# Altium project 14-Bit_ADC_ADC.PrjPcb
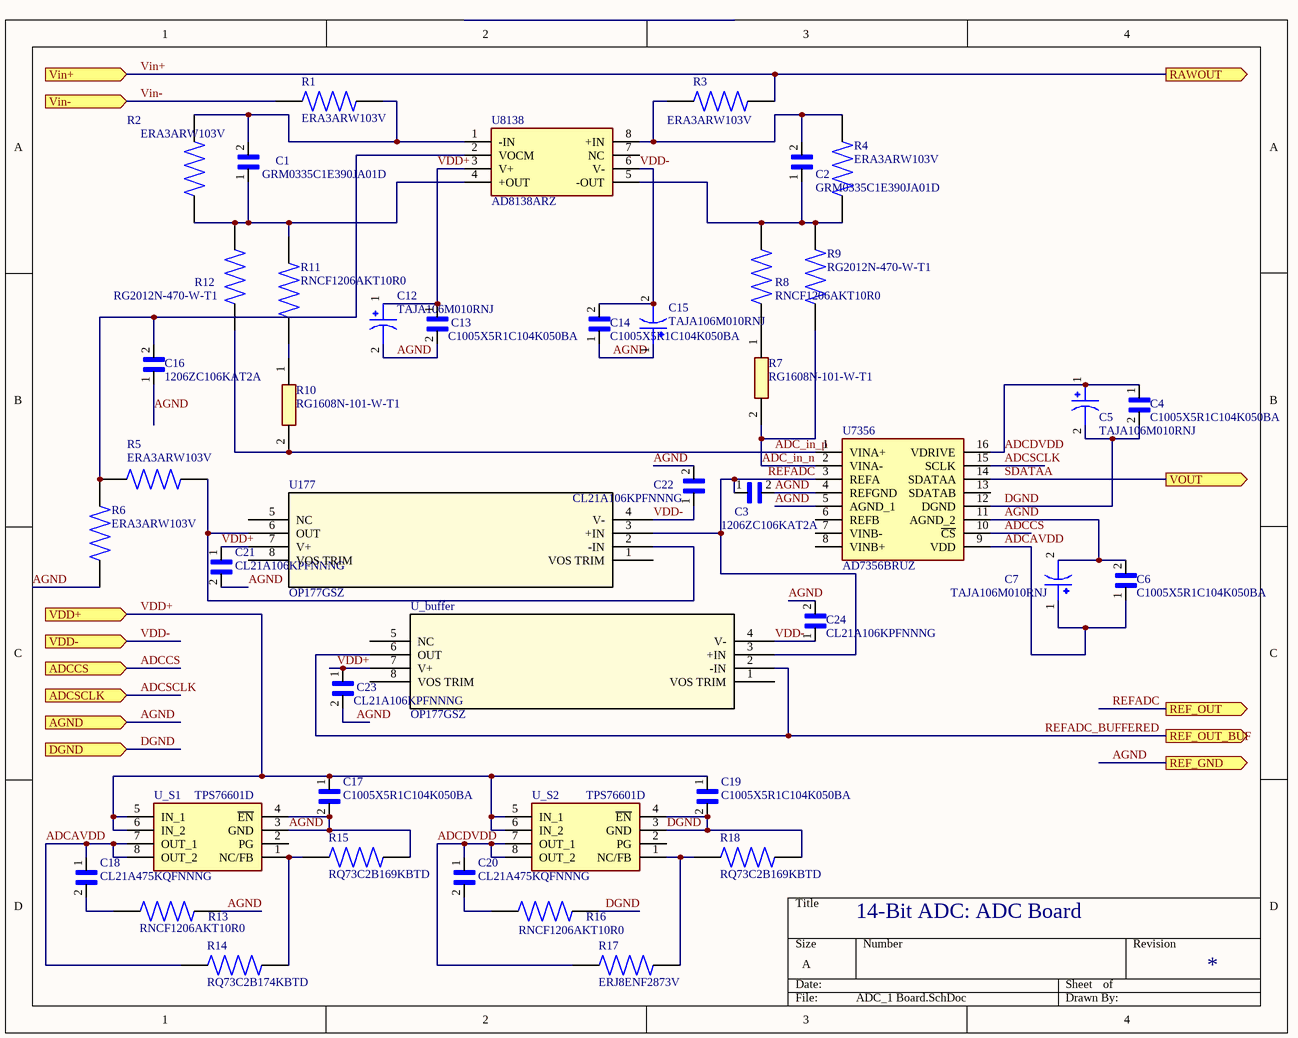
[diagram p0: ADC_1 Board.SchDoc]
1 sheet, 44 parts. Net scope: flat (ports and power ports of the same name join across sheets).
Board file: ADC_PCB.PcbDoc

## Sheet ADC_1 Board.SchDoc
size A; SheetNumber: 1; SheetTotal: 2; SPICEModelCachePBYFTRTB: <root> / <DocumentId>PBYFTRTB</DocumentId> / <CacheFrame Number="0"> / <Model Name="op1177" Kind="CKT"> / <Text>* OP1177 SPICE Macro-model / * Description: Amplifier / * Generic Desc: 6/30V, BIP, OP, Low Vos, Low TcVos, 1X / * Developed by: SB, ADSiV apps / * Revision History: 08/10/2012 - Updated to new header style / * 1.0 (05/2002) / * Copyright 2002, 2012 by Analog Devices, Inc. / * / * Refer to http://www.analog.com/Analog_Root/static/techSupport/designTools/spiceModels/license/spice_general.html for License Statement. Use of this model / * indicates your acceptance of the terms and provisions in the License Statement. / * / * BEGIN Notes: / * / * Not Modeled: / * / * Parameters modeled include: Vsy=±15V / * / * END Notes / * / * Node assignments / *               non-inverting input / *               | inverting input / *               | | positive supply / *               | | |  negative supply / *               | | |  |  output / *               | | |  |  | / *               | | |  |  | / .SUBCKT OP1177  1 2 99 50 34 / * / * INPUT STAGE &amp; POLE AT 100 MHZ / * / R3   5 51     6.8E3 / R4   6 51     6.8E3 / CIN  1  2     1.5E-12 / C2   5  6      3.5E-12 / I1   97 4      500E-6 / IOS  1  2     0.1E-9 / EOS  9  3     POLY(2)  (26, 28) (73, 98) 15E-6  1 1 / Q1   5  2  7  QX / Q2   6  9  8  QX / R5   7  4     50 / R6   8  4     50 / D1   2 36     DZ / D2   1 36     DZ / EN   3  1     10  0  1 / GN1  0  2     13  0  1 / GN2  0  1     16  0  1 / * / EREF 98 0     28  0  1 / EP   97 0     99  0  1 / EM   51 0     50  0  1 / * / * VOLTAGE NOISE SOURCE / * / DN1  35 10    DEN / DN2  10 11    DEN / VN1  35  0    DC 2 / VN2  0  11    DC 2 / * / * CURRENT NOISE SOURCE / * / DN3  12 13    DIN / DN4  13 14    DIN / VN3  12  0    DC 2 / VN4  0  14    DC 2 / * / * CURRENT NOISE SOURCE / * / DN5  15 16    DIN / DN6  16 17    DIN / VN5  15  0    DC 2 / VN6  0  17    DC 2 / * / * GAIN STAGE &amp; DOMINANT POLE AT 0.439 HZ / * / R7  18 98     1.45E7 / C3  18 98     25E-9 / G1  98 18     5  6  5.15E-3 / V2  97 19     1.5 / V3  20 51     1.5 / D3  18 19     DX / D4  20 18     DX / * / * POLE/ZERO PAIR AT 1.5MHz/12.7MHz / * / R8  21 98     1E3 / R9  21 22     1.25E3 / C4  22 98     10E-12 / G2  98 21     18 28  1E-3 / * / * POLE AT 2568 MHz / * / R10 23 98     1 / C5  23 98     62E-12 / G3  98 23     21 28  1 / * / * POLE AT 2568 MHz / * / R11 24 98     1 / C6  24 98     62E-12 / G4  98 24     23 28  1 / * / * POLE AT 2568 MHz / * / R14 27 98     1 / C8  27 98    62E-12 / G5  98 27     24 28  1 / * / * COMMON-MODE GAIN NETWORK WITH ZERO AT 1 kHZ / * / R12 25 26     1E6 / C7  25 26     159.155E-12 / R13 26 98     1 / E2  25 98      POLY(2) 1 98 2 98 0 0.28 0.28 / * / *PSRR=121dB / EPSY 98 72 POLY(1) (99,50) 0 1 / RPS3 72 73 1E6 / CPS3 72 73 3E-9 / RPS4 73 98 1 / * OUTPUT STAGE / * / R15 28 99     100E3 / R16 28 50     100E3 / C9  28 50     1E-6 / ISY 99 50     250E-6 / R17 29 99     100 / R18 29 50     100 / L2  29 34     1E-9 / G6  32 50     27 29  10E-3 / G7  33 50     29 27  10E-3 / G8  29 99     99 27  10E-3 / G9  50 29     27 50  10E-3 / V4  30 29     1.3 / V5  29 31     3.8 / F1  29  0     V4  1 / F2  0  29     V5  1 / D5  27 30     DX / D6  31 27     DX / D7  99 32     DX / D8  99 33     DX / D9  50 32     DY / D10 50 33     DY / * / * MODELS USED / * / .MODEL QX PNP(BF=5E5) / .MODEL DX   D(IS=1E-12) / .MODEL DY   D(IS=1E-15 BV=50) / .MODEL DZ   D(IS=1E-15 BV=7.0) / .MODEL DEN  D(IS=1E-12 RS=6.8E3 KF=1.95E-15 AF=1) / .MODEL DIN  D(IS=1E-12 RS=77.3E-6 KF=3.38E-15 AF=1) / .ENDS OP1177</Text> / </Model> / </CacheFrame> / </root>

### Parts
C1  GRM0335C1E390JA01D  [CAPC0603X33N]
C2  GRM0335C1E390JA01D  [CAPC0603X33N]
C3  1206ZC106KAT2A  [CAPC3216X178N]
C4  C1005X5R1C104K050BA  [CAPC1005X55N]
C5  TAJA106M010RNJ  [CAPMP3216X180N]
C6  C1005X5R1C104K050BA  [CAPC1005X55N]
C7  TAJA106M010RNJ  [CAPMP3216X180N]
C12  TAJA106M010RNJ  [CAPMP3216X180N]
C13  C1005X5R1C104K050BA  [CAPC1005X55N]
C14  C1005X5R1C104K050BA  [CAPC1005X55N]
C15  TAJA106M010RNJ  [CAPMP3216X180N]
C16  1206ZC106KAT2A  [CAPC3216X178N]
C17  C1005X5R1C104K050BA  [CAPC1005X55N]
C18  CL21A475KQFNNNG  [CAPC2012X135N]
C19  C1005X5R1C104K050BA  [CAPC1005X55N]
C20  CL21A475KQFNNNG  [CAPC2012X135N]
C21  CL21A106KPFNNNG  [CAPC2012X135N]
C22  CL21A106KPFNNNG  [CAPC2012X135N]
C23  CL21A106KPFNNNG  [CAPC2012X135N]
C24  CL21A106KPFNNNG  [CAPC2012X135N]
R1  ERA3ARW103V  [RES_ERA3ARW103V]
R2  ERA3ARW103V  [RES_ERA3ARW103V]
R3  ERA3ARW103V  [RES_ERA3ARW103V]
R4  ERA3ARW103V  [RES_ERA3ARW103V]
R5  ERA3ARW103V  [RES_ERA3ARW103V]
R6  ERA3ARW103V  [RES_ERA3ARW103V]
R7  RG1608N-101-W-T1  [RESC1608X50N]
R8  RNCF1206AKT10R0  [RESC3015X65N]
R9  RG2012N-470-W-T1  [RESC2012X50N]
R10  RG1608N-101-W-T1  [RESC1608X50N]
R11  RNCF1206AKT10R0  [RESC3015X65N]
R12  RG2012N-470-W-T1  [RESC2012X50N]
R13  RNCF1206AKT10R0  [RESC3015X65N]
R14  RQ73C2B174KBTD  [RESC3116X75N]
R15  RQ73C2B169KBTD  [RESC3116X75N]
R16  RNCF1206AKT10R0  [RESC3015X65N]
R17  ERJ8ENF2873V  [RES_ERJ8ENF2873V]
R18  RQ73C2B169KBTD  [RESC3116X75N]
U177  OP177GSZ  [R_8_ADI]
U7356  AD7356BRUZ  [SOP65P640X120-16N]
U8138  AD8138ARZ  [SOIC127P600X175-8N]
U_buffer  OP177GSZ  [R_8_ADI]
U_S1  TPS76601D  [SOIC127P600X175-8N]
U_S2  TPS76601D  [SOIC127P600X175-8N]

### Ports
ADCCS (in), ADCSCLK (in), AGND (in), DGND (in), RAWOUT (out), REF_GND (out), REF_OUT (out), REF_OUT_BUF (out), VDD+ (in), VDD- (in), Vin+ (in), Vin- (in), VOUT (out)

### Nets
ADC_in_n: R7.2 R9.2 U7356.2(VINA-)
ADC_in_p: R10.2 R12.2 U7356.1(VINA+)
ADCAVDD: C6.1 C7.1 C18.1 R14.1 U7356.9(VDD) U_S1.7(OUT_1) U_S1.8(OUT_2)
ADCCS: U7356.10(~{CS}) ; port ADCCS
ADCDVDD: C4.1 C5.1 C20.1 R17.1 U7356.16(VDRIVE) U_S2.7(OUT_1) U_S2.8(OUT_2)
ADCSCLK: U7356.15(SCLK) ; port ADCSCLK
AGND: C3.2 C6.2 C7.2 C12.2 C13.2 C14.1 C15.1 C16.1 C17.2 C21.2 C22.2 C23.2 C24.2 R6.2 R13.1 R15.2 U7356.4(REFGND) U7356.5(AGND_1) U7356.11(AGND_2) U_S1.3(GND) U_S1.4(~{EN}) ; port AGND, port REF_GND
DGND: C4.2 C5.2 C19.2 R16.1 R18.2 U7356.12(DGND) U_S2.3(GND) U_S2.4(~{EN}) ; port DGND
REFADC: C3.1 U177.3(+IN) U7356.3(REFA) U_buffer.3(+IN) ; port REF_OUT
REFADC_BUFFERED: U_buffer.2(-IN) U_buffer.6(OUT) ; port REF_OUT_BUF
SDATAA: U7356.14(SDATAA) ; port VOUT
VDD+: C12.1 C13.1 C17.1 C19.1 C21.1 C23.1 U177.7(V+) U8138.3(V+) U_buffer.7(V+) U_S1.5(IN_1) U_S1.6(IN_2) U_S2.5(IN_1) U_S2.6(IN_2) ; port VDD+
VDD-: C14.2 C15.2 C22.1 C24.1 U177.4(V-) U8138.6(V-) U_buffer.4(V-) ; port VDD-
Vin+: R3.1 ; port Vin+, port RAWOUT
Vin-: R1.2 ; port Vin-
NetC1_1: C1.1 R2.2 R11.1 R12.1 U8138.4(+OUT)
NetC1_2: C1.2 R1.1 R2.1 U8138.1(-IN)
NetC2_1: C2.1 R4.2 R8.2 R9.1 U8138.5(-OUT)
NetC2_2: C2.2 R3.2 R4.1 U8138.8(+IN)
NetC16_2: C16.2 R5.1 R6.1 U8138.2(VOCM)
NetC18_2: C18.2 R13.2
NetC20_2: C20.2 R16.2
NetR5_2: R5.2 U177.2(-IN) U177.6(OUT)
NetR7_1: R7.1 R8.1
NetR10_1: R10.1 R11.2
NetR14_2: R14.2 R15.1 U_S1.1(NC/FB)
NetR17_2: R17.2 R18.1 U_S2.1(NC/FB)

Not connected (* = marked no-connect by the designer): U177 1(VOS_TRIM) 5(NC) 8(VOS_TRIM); U7356 6(REFB) 7(VINB-) 8(VINB+) 13(SDATAB); U8138 7(NC); U_buffer 1(VOS_TRIM) 5(NC) 8(VOS_TRIM); U_S1 2(PG); U_S2 2(PG)

### Notes on the sheet
- 14-Bit ADC: ADC Board

### Library data of the parts
C1 C2 = GRM0335C1E390JA01D: SMD Capacitor C0G(EIA) with Capacitance: 39pF Tol. 5%. Rated Voltage: 25Vdc; Package: None; Price: None; Value: *; MP: GRM0335C1E390JA01D; Availability: Unavailable
C3 C16 = 1206ZC106KAT2A: 10ÂµF Â±10% 10V Ceramic Capacitor X7R 1206 (3216 Metric); MF: AVX; Package: 3216 AVX; MP: 1206ZC106KAT2A; Availability: Warning; Price: None; Purchase-URL: https://pricing.snapeda.com/search/part/1206ZC106KAT2A/?ref=eda; Value: *; SnapEDA_Link: https://www.snapeda.com/parts/1206ZC106KAT2A/AVX/view-part/1765308/?ref=snap
C4 C6 C13 C14 C17 C19 = C1005X5R1C104K050BA: CERAMIC CAPACITOR, 0.1UF, 16V, X5R, 10%, 0402; Package: None; Price: None; Value: *; MP: C1005X5R1C104K050BA; Availability: Unavailable
C5 C7 C12 C15 = TAJA106M010RNJ: 10ÂµF Molded Tantalum Capacitors 10V 1206 (3216 Metric) 3Ohm; MF: AVX; MP: TAJA106M010RNJ; SnapEDA_Link: https://www.snapeda.com/parts/TAJA106M010RNJ/AVX/view-part/1681918/?ref=snap; Arrow_Electronics-Purchase-URL: https://snapeda.com/shop?store=Arrow+Electronics&id=1681918; Availability: Warning; Mouser-Purchase-URL: https://snapeda.com/shop?store=Mouser&id=1681918; Package: 1206 AVX; Value: *; Price: None
C18 C20 = CL21A475KQFNNNG: 4.7U 6.3V K0805 X5R; Package: None; Price: None; Value: *; MP: CL21A475KQFNNNG; Availability: Unavailable
C21-C24 = CL21A106KPFNNNG: 10ÂµF Â±10% 10V Ceramic Capacitor X5R 0805 (2012 Metric); MF: Samsung Electro-Mechanics; SnapEDA_Link: https://www.snapeda.com/parts/CL21A106KPFNNNG/Samsung%20Electro-Mechanics/view-part/3598324/?ref=snap; Value: *; Arrow_Electronics-Purchase-URL: https://snapeda.com/shop?store=Arrow+Electronics&id=3598324; Digi-Key_Part_Number: 1276-6456-1-ND; Mouser-Purchase-URL: https://snapeda.com/shop?store=Mouser&id=3598324; MP: CL21A106KPFNNNG; Package: 0805 Samsung; DigiKey-Purchase-URL: https://snapeda.com/shop?store=DigiKey&id=3598324
R7 R10 = RG1608N-101-W-T1: Resistor; Manufacturer_Name: Susumu; Datasheet Link: https://componentsearchengine.com/Datasheets/1/RG1608N-101-W-T1.pdf; Height: 0.5mm; Manufacturer_Part_Number: RG1608N-101-W-T1
U177 U_buffer = OP177GSZ: No Description Available; Vendor: Analog Devices Inc; Built_By: EMA_UL_Team; SourceLibrary: Analog_2012-01-01_9; Manufacturer_Part_Number: OP177GSZ; Copyright: Copyright (C) 2021 Accelerated Designs. All rights reserved; RefDes: RefDes; Type: DEV
U7356 = AD7356BRUZ: Integrated Circuit; Manufacturer_Name: Analog Devices; Datasheet Link: http://www.analog.com/static/imported-files/data_sheets/AD7356.pdf; Height: 1.2mm; Manufacturer_Part_Number: AD7356BRUZ
U8138 = AD8138ARZ: Integrated Circuit; Manufacturer_Name: Analog Devices; Datasheet Link: https://componentsearchengine.com//AD8138ARZ.pdf; Height: 1.75mm; Mouser2 Part Number: 584-AD8138ARZ; Mouser2 Price/Stock: https://www.mouser.com/Search/Refine.aspx?Keyword=584-AD8138ARZ; Manufacturer_Part_Number: AD8138ARZ
U_S1 U_S2 = TPS76601D: Integrated Circuit; Manufacturer_Name: Texas Instruments; Datasheet Link: https://www.ti.com/lit/ds/symlink/tps766.pdf?ts=1633601131788&ref_url=https%253A%252F%252Fwww.ti.com%252Fstore%252Fti%252Fen%252Fp%252Fproduct%252F%253Fp%253DTPS76601D%2526keyMatch%253DTPS76601D%2526tisearch%253Dsearch-everything%2526usecase%253DOPN; Height: 1.75mm; Manufacturer_Part_Number: TPS76601D
R1-R6 = ERA3ARW103V: MP: ERA3ARW103V; Package: None; Price: None; Availability: Unavailable; Value: *
R8 R11 R13 R16 = RNCF1206AKT10R0: Package: None; Price: None; Value: *; MP: RNCF1206AKT10R0; Availability: Unavailable
R9 R12 = RG2012N-470-W-T1: Package: None; Price: None; Value: *; MP: RG2012N-470-W-T1; Availability: Unavailable
R14 = RQ73C2B174KBTD: Package: None; Price: None; Value: *; MP: RQ73C2B174KBTD; Availability: Unavailable
R15 R18 = RQ73C2B169KBTD: Package: None; Price: None; Value: *; MP: RQ73C2B169KBTD; Availability: Unavailable
R17 = ERJ8ENF2873V: MP: ERJ8ENF2873V; Package: None; Availability: Unavailable; Price: None; Value: *